# EAGLE schematic MainBoard (EAGLE 9.1.3)

## Sheet 1 of 2: Power Supply
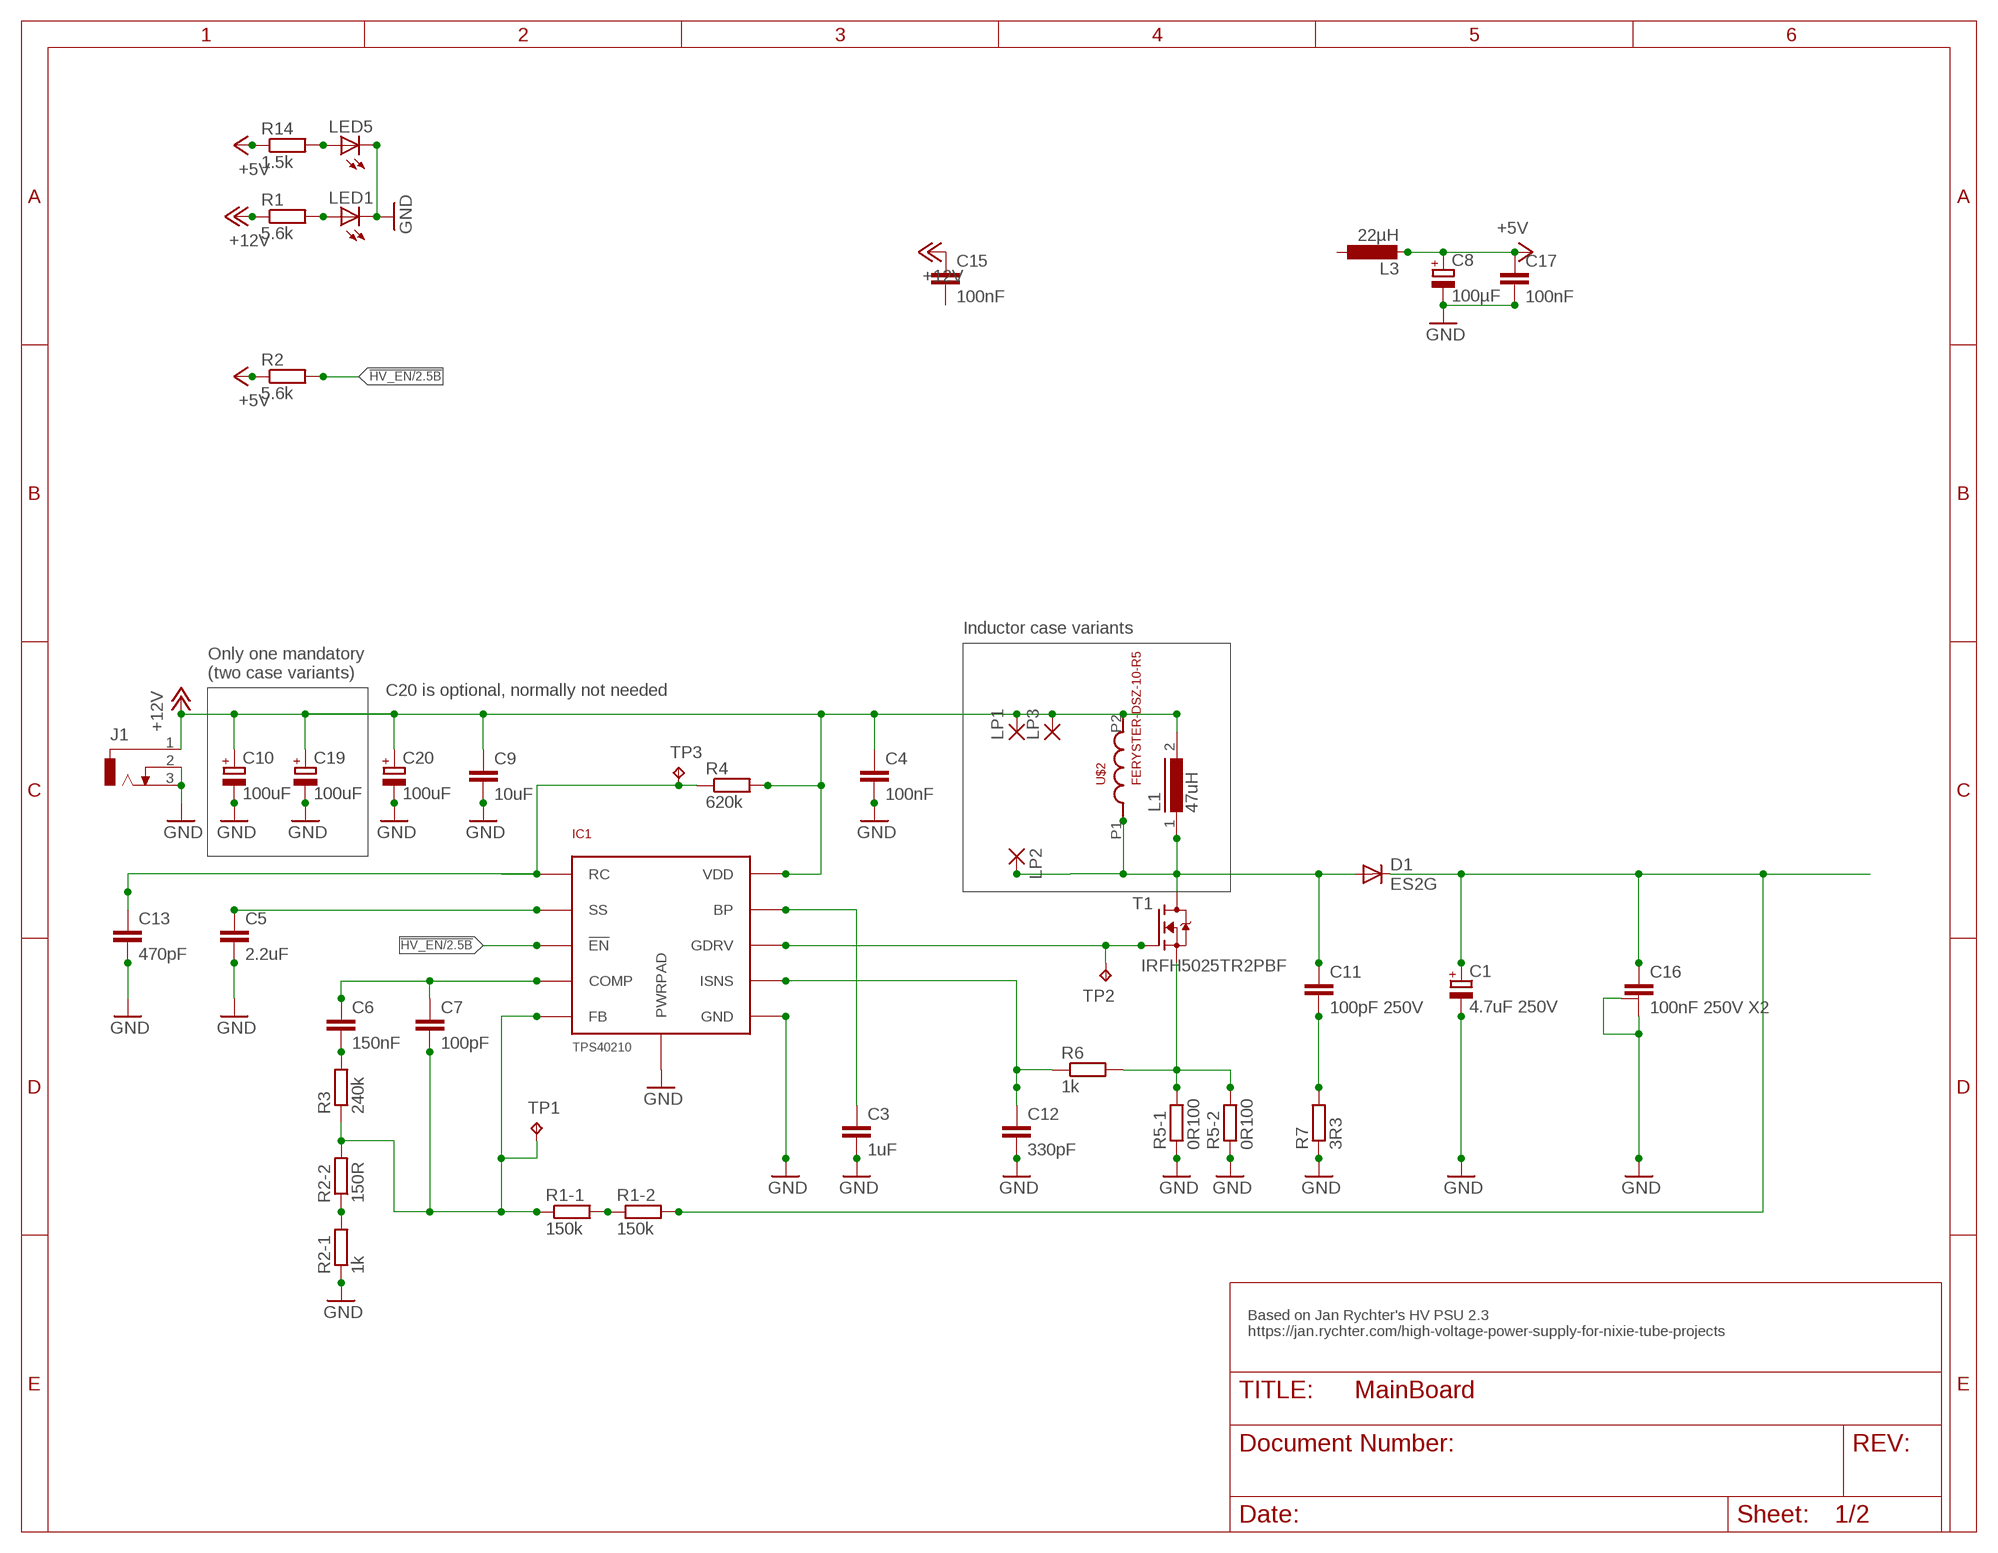
[diagram p0: schematic, sheet 1]

### Parts
C1  4.7uF 250V  CPOL-EUE3.5-8  [E3,5-8]
C3  1uF  C-EUC0603  [C0603]
C4  100nF  C-EUC0603  [C0603]
C5  2.2uF  C-EUC1206  [C1206]
C6  150nF  C-EUC0603  [C0603]
C7  100pF  C-EUC0603  [C0603]
C8  100µF  CPOL-EUCT7343  [CT7343]
C9  10uF  C-EUC1206  [C1206]
C10  100uF  CPOL-EUE2.5-6  [E2,5-6]
C11  100pF 250V  C-EUC1812  [C1812]
C12  330pF  C-EUC0603  [C0603]
C13  470pF  C-EUC0603  [C0603]
C15  100nF  C-EUC0805  [C0805]
C16  100nF 250V X2  C-EU-3PIN102_152-062X184  [C102_152-062X184]
C17  100nF  C-EUC0805  [C0805]
C19  100uF  CPOL-EUE3.5-8  [E3,5-8]
C20  100uF  CPOL-EUE2.5-6  [E2,5-6]
D1  ES2G  DIODE-DO-214AC  [DO-214AC]
IC1  TPS40210DGQ  [MSOP10]
J1  DCJ0303  [DCJ0303]
L1  47uH  DR125  [DR125]
L3  22µH  SRR1050A  [SRR1050A]
LED1  LEDCHIPLED_1206  [CHIPLED_1206]
LED5  LEDCHIPLED_1206  [CHIPLED_1206]
LP1  3,17/1,3  [3,17/1,3]
LP2  3,17/1,3  [3,17/1,3]
LP3  3,17/1,3  [3,17/1,3]
R1  5.6k  R-EU_M0805  [M0805]
R1-1  150k  R-EU_R0805  [R0805]
R1-2  150k  R-EU_R0805  [R0805]
R2  5.6k  R-EU_M0805  [M0805]
R2-1  1k  R-EU_R0603  [R0603]
R2-2  150R  R-EU_R0603  [R0603]
R3  240k  R-EU_R0603  [R0603]
R4  620k  R-EU_R0603  [R0603]
R5-1  0R100  R-EU_R1206  [R1206]
R5-2  0R100  R-EU_R1206  [R1206]
R6  1k  R-EU_R0603  [R0603]
R7  3R3  R-EU_R0805  [R0805]
R14  1.5k  R-EU_M0805  [M0805]
T1  IRFH5025PBF  [PQFN5X6]
TP1  TPTP08SQ  [TP08SQ]
TP2  TPTP08SQ  [TP08SQ]
TP3  TPTP08SQ  [TP08SQ]
U$2  FERYSTER-DSZ-10-R5  [DSZ-10-R5]

### Nets
!HV_EN: IC1.P$3(!EN) R2.2 ; also sheet 2
+5V: C8.+ C17.1 L3.P$2 R2.1 R14.1 ; also sheet 2
+12V: C4.1 C9.1 C10.+ C15.1 C19.+ C20.+ IC1.P$10(VDD) J1.1 L1.2 LP1.1(P) LP3.1(P) R1.1 R4.2 U$2.P2 ; also sheet 2
COMP: C6.1 C7.1 IC1.P$4(COMP)
D: R5-1.2 R5-2.2 R6.2 T1.S1(S) T1.S2(S) T1.S3(S) T1.S4(S)
FB: C7.2 IC1.P$5(FB) R1-1.1 R2-2.2 R3.1 TP1.TP
GDRV: IC1.P$8(GDRV) T1.G TP2.TP
GND: C1.- C3.2 C4.2 C5.2 C8.- C9.2 C10.- C12.2 C13.2 C16.2 C16.3 C17.2 C19.- C20.- IC1.P$6(GND) IC1.PWRPAD J1.2 J1.3 LED1.C LED5.C R2-1.1 R5-1.1 R5-2.1 R7.1 ; also sheet 2
HV: C1.+ C16.1 D1.C R1-2.2 ; also sheet 2
N$1: LED5.A R14.2
N$2: LED1.A R1.2
N$4: R1-1.2 R1-2.1
N$7: C13.1 IC1.P$1(RC) R4.1 TP3.TP
N$8: C3.1 IC1.P$9(BP)
N$9: C6.2 R3.2
N$12: R2-1.2 R2-2.1
N$13: C5.1 IC1.P$2(SS)
N$15: C11.2 R7.2
PULSE: C11.1 D1.A L1.1 LP2.1(P) T1.D1(D) T1.D2(D) T1.D3(D) T1.D4(D) T1.D5(D) U$2.P1
SNS: C12.1 IC1.P$7(ISNS) R6.1
Unconnected: C15.2 L3.P$1

### Notes on the sheet
- Inductor case variants
- Only one mandatory
  (two case variants)
- C20 is optional, normally not needed
- IRFH5025TR2PBF
- Based on Jan Rychter's HV PSU 2.3
  https://jan.rychter.com/high-voltage-power-supply-for-nixie-tube-projects

## Sheet 2 of 2
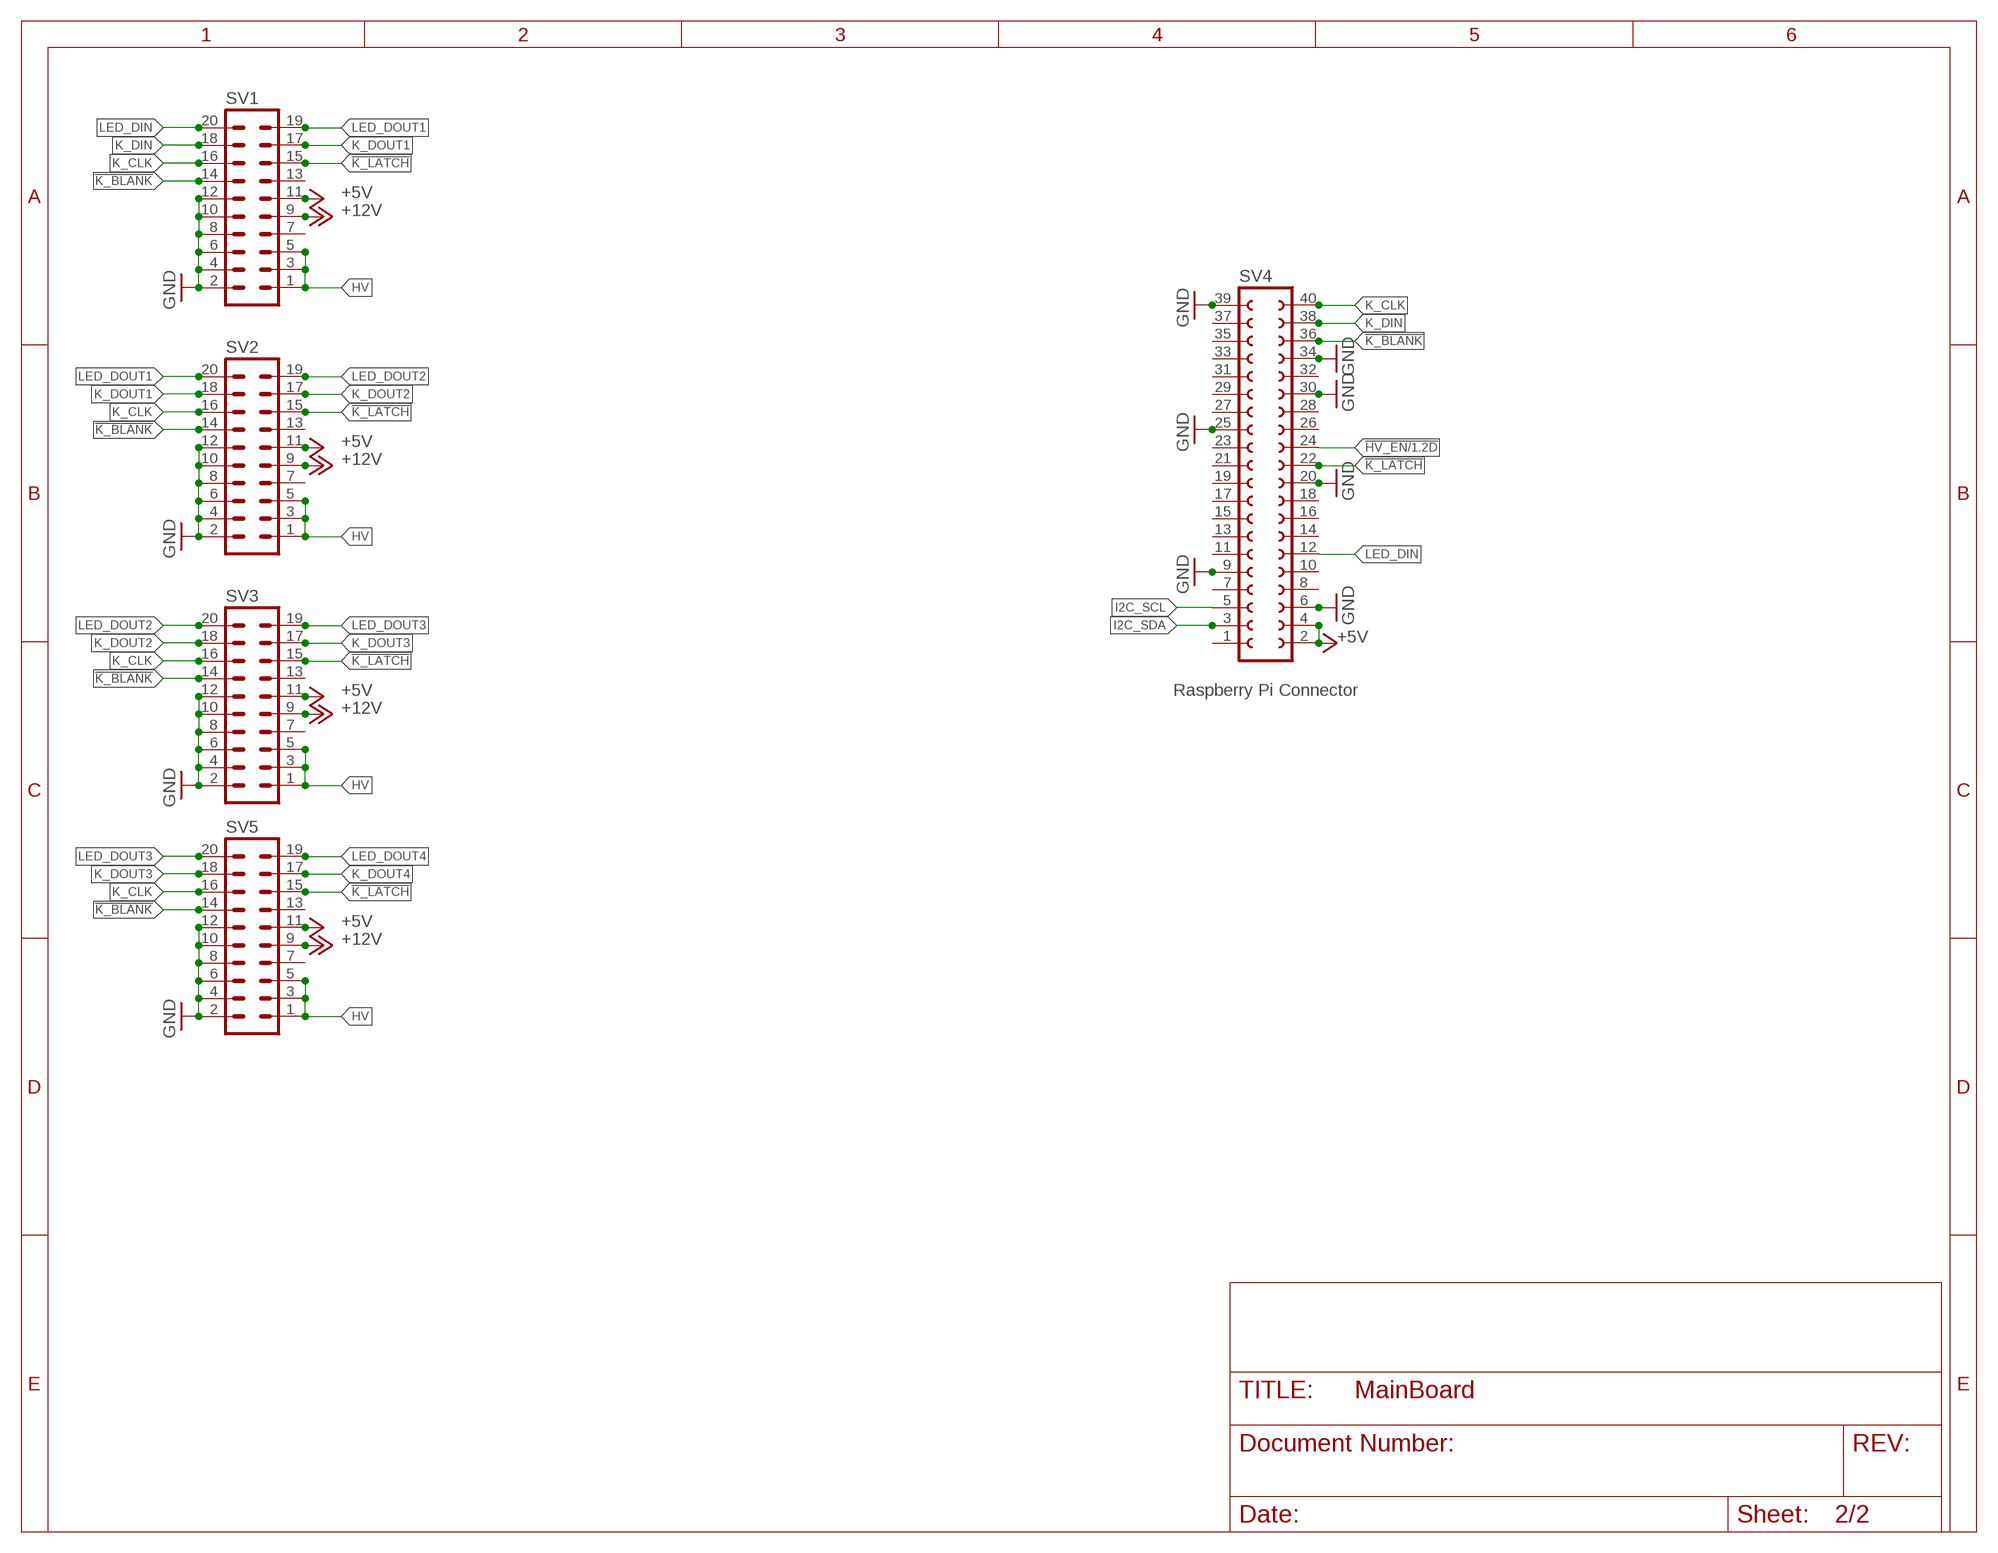
[diagram p1: schematic, sheet 2]

### Parts
SV1  MA10-2  [MA10-2]
SV2  MA10-2  [MA10-2]
SV3  MA10-2  [MA10-2]
SV4  FE20-2  [FE20-2]
SV5  MA10-2  [MA10-2]

### Nets
!HV_EN: SV4.24 ; also sheet 1
!K_BLANK: SV1.14 SV2.14 SV3.14 SV4.36 SV5.14
!K_LATCH: SV1.15 SV2.15 SV3.15 SV4.22 SV5.15
+5V: SV1.11 SV2.11 SV3.11 SV4.2 SV4.4 SV5.11 ; also sheet 1
+12V: SV1.9 SV2.9 SV3.9 SV5.9 ; also sheet 1
GND: SV1.2 SV1.4 SV1.6 SV1.8 SV1.10 SV1.12 SV2.2 SV2.4 SV2.6 SV2.8 SV2.10 SV2.12 SV3.2 SV3.4 SV3.6 SV3.8 SV3.10 SV3.12 SV4.6 SV4.9 SV4.20 SV4.25 SV4.30 SV4.34 SV4.39 SV5.2 SV5.4 SV5.6 SV5.8 SV5.10 SV5.12 ; also sheet 1
HV: SV1.1 SV1.3 SV1.5 SV2.1 SV2.3 SV2.5 SV3.1 SV3.3 SV3.5 SV5.1 SV5.3 SV5.5 ; also sheet 1
I2C_SCL: SV4.5
I2C_SDA: SV4.3
K_CLK: SV1.16 SV2.16 SV3.16 SV4.40 SV5.16
K_DIN: SV1.18 SV4.38
K_DOUT1: SV1.17 SV2.18
K_DOUT2: SV2.17 SV3.18
K_DOUT3: SV3.17 SV5.18
K_DOUT4: SV5.17
LED_DIN: SV1.20 SV4.12
LED_DOUT1: SV1.19 SV2.20
LED_DOUT2: SV2.19 SV3.20
LED_DOUT3: SV3.19 SV5.20
LED_DOUT4: SV5.19
Unconnected: SV1.7 SV1.13 SV2.7 SV2.13 SV3.7 SV3.13 SV4.1 SV4.7 SV4.8 SV4.10 SV4.11 SV4.13 SV4.14 SV4.15 SV4.16 SV4.17 SV4.18 SV4.19 SV4.21 SV4.23 SV4.26 SV4.27 SV4.28 SV4.29 SV4.31 SV4.32 SV4.33 SV4.35 SV4.37 SV5.7 SV5.13

### Notes on the sheet
- Raspberry Pi Connector

## Library data of the parts
C1 C10 C19 C20 = rcl:CPOL-EU: POLARIZED CAPACITOR, European symbol
C3-C7 C9 C11-C13 = rcl:C-EU: CAPACITOR, European symbol
C8 = rcl:CPOL-EU: POLARIZED CAPACITOR, European symbol; MOUSER: 581-NOSD107M006; SPICEPREFIX: C
C15 C17 = rcl:C-EU: CAPACITOR, European symbol; MOUSER: 710-885012207072; SPICEPREFIX: C
C16 = jwr:C-EU-3PIN: CAPACITOR, European symbol
D1 = diode:DIODE-: DIODE
IC1 = TI-power:TPS40210
J1 = con-jack:DCJ0303: DC POWER JACK Source: DCJ0303.pdf; OC_FARNELL: unknown; OC_NEWARK: unknown
L1 = inductors:DR125: High Power Density, High Efficiency, Shielded Inductors Source: coiltronics_dr_series.pdf
L3 = lichtenstein_onion:SRR1050A: SRR1050A Series - Shielded Power Inductors Datasheet <https://www.mouser.com/datasheet/2/54/rr1050a-964771.pdf>; MOUSER: 652-SRR1050A-220Y
LED1 LED5 = led:LED: LED OSRAM: - CHIPLED LG R971, LG N971, LY N971, LG Q971, LY Q971, LO R971, LY R971 LH N974, LH R974 LS Q976, LO Q976, LY Q976 LO Q996 - Hyper CHIPLED LW Q18S LB Q993, LB Q99A, LB R99A - SideLED LS A670, LO A670, LY A670, LG A670, LP A670 LB A673, LV A673, LT A673, LW A673 LH A674 LY A675 LS A676, LA A676, LO A676, LY A676, LW A676 LS A679, LY A679, LG A679 - Hyper Micro SIDELED® LS Y876, LA Y876, LO Y876, LY Y876 LT Y87S - SmartLED LW L88C, LW L88S LB L89C, LB L89S, LG L890 LS L89K, LO L89K, LY L89K LS L896, LA L896, LO L896, LY L896 - TOPLED LS T670, LO T670, LY T670, LG T670, LP T670 LSG T670, LSP T670, LSY T670, LOP T670, LYG T670 LG T671, LOG T671, LSG T671 LB T673, LV T673, LT T673, LW T673 LH T674 LS T676, LA T676, LO T676, LY T676, LB T676, LH T676, LSB T676, LW T676 LB T67C, LV T67C, LT T67C, LS T67K, LO T67K, LY T67K, LW E67C LS E67B, LA E67B, LO E67B, LY E67B, LB E67C, LV E67C, LT E67C LW T67C LS T679, LY T679, LG T679 LS T770, LO T770, LY T770, LG T770, LP T770 LB T773, LV T773, LT T773, LW T773 LH T774 LS E675, LA E675, LY E675, LS T675 LS T776, LA T776, LO T776, LY T776, LB T776 LHGB T686 LT T68C, LB T68C - Hyper Mini TOPLED® LB M676 - Mini TOPLED Santana® LG M470 LS M47K, LO M47K, LY M47K Source: http://www.osram.convergy.de LUXEON: - LUMILED® LXK2-PW12-R00, LXK2-PW12-S00, LXK2-PW14-U00, LXK2-PW14-V00 LXK2-PM12-R00, LXK2-PM12-S00, LXK2-PM14-U00 LXK2-PE12-Q00, LXK2-PE12-R00, LXK2-PE12-S00, LXK2-PE14-T00, LXK2-PE14-U00 LXK2-PB12-K00, LXK2-PB12-L00, LXK2-PB12-M00, LXK2-PB14-N00, LXK2-PB14-P00, LXK2-PB14-Q00 LXK2-PR12-L00, LXK2-PR12-M00, LXK2-PR14-Q00, LXK2-PR14-R00 LXK2-PD12-Q00, LXK2-PD12-R00, LXK2-PD12-S00 LXK2-PH12-R00, LXK2-PH12-S00 LXK2-PL12-P00, LXK2-PL12-Q00, LXK2-PL12-R00 Source: www.luxeon.com KINGBRIGHT: KA-3528ASYC Source: www.kingbright.com; MOUSER: 604-APTR3216SGC
LP1-LP3 = wirepad:3,17/1,3: THROUGH-HOLE PAD
R1 R2 = rcl:R-EU_: RESISTOR, European symbol; MOUSER: 652-CR0805FX-5601ELF; SPICEPREFIX: R
R1-1 R1-2 R2-1 R2-2 R3 R4 R5-1 R5-2 R6 R7 = rcl:R-EU_: RESISTOR, European symbol
R14 = rcl:R-EU_: RESISTOR, European symbol; MOUSER: 652-CR0805FX-1501ELF; SPICEPREFIX: R
SV1-SV3 SV5 = con-lstb:MA10-2: PIN HEADER; OC_FARNELL: unknown; OC_NEWARK: unknown
SV4 = con-lsta:FE20-2: FEMALE HEADER; OC_FARNELL: unknown; OC_NEWARK: unknown
T1 = IRFH5025:IRFH5025: IRFH5025PBF HEXFET Power MOSFET
TP1-TP3 = testpad:TP: Test pad
U$2 = jwr:FERYSTER-DSZ